# EAGLE schematic Board (EAGLE 9.6.2)
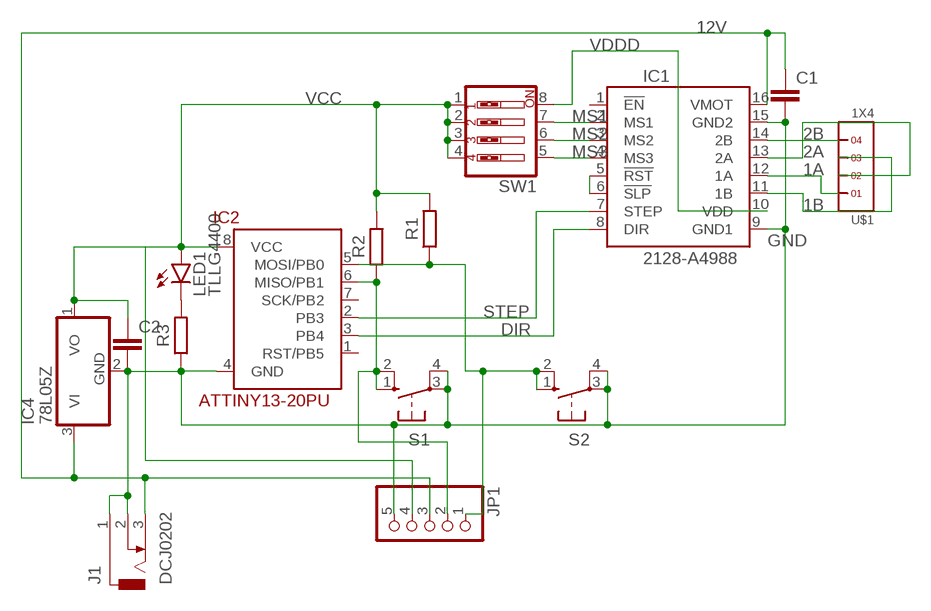
[diagram p0: schematic, sheet 1]

## Parts
C1  C2.5/6  [C2.5-6]
C2  C2.5/6  [C2.5-6]
IC1  2128-A4988  [A4988]
IC2  ATTINY13-20PU  [DIL08]
IC4  78L05Z  [TO92]
J1  DCJ0202  [DCJ0202]
JP1  PINHD-1X5  [1X05]
LED1  TLLG4400  [LED3MM]
R1  R_AXIAL-7.2MM-PITCH  [RESAD724W46L381D178B]
R2  R_AXIAL-7.2MM-PITCH  [RESAD724W46L381D178B]
R3  R_AXIAL-7.2MM-PITCH  [RESAD724W46L381D178B]
S1  10-XX  [B3F-10XX]
S2  10-XX  [B3F-10XX]
SW1  SW_DIP-4  [EDG-04]
U$1  1X4  [1X4]

## Nets
1A: IC1.12(1A) U$1.1
1B: IC1.11(1B) U$1.3
2A: IC1.13(2A) U$1.2
2B: IC1.14(2B) U$1.4
12V: C1.1 IC1.16(VMOT) IC4.3(VI) J1.3 JP1.3
DIR: IC1.8(DIR) IC2.3(PB4)
GND: C1.2 C2.2 IC1.9(GND1) IC1.15(GND2) IC2.4(GND) IC4.2(GND) J1.1 J1.2 JP1.5 R3.1 S1.3(P) S1.4(P1) S2.3(P) S2.4(P1)
MS1: IC1.2(MS1) SW1.7
MS2: IC1.3(MS2) SW1.6
MS3: IC1.4(MS3) SW1.5
N$7: LED1.K(C) R3.2
N$8: IC2.5(MOSI/PB0) JP1.1 R1.1 S2.1(S) S2.2(S1)
N$10: IC1.5(!RST) IC1.6(!SLP)
PB1: IC2.6(MISO/PB1) JP1.2 R2.1 S1.1(S) S1.2(S1)
STEP: IC1.7(STEP) IC2.2(PB3)
VCC: C2.1 IC2.8(VCC) IC4.1(VO) JP1.4 LED1.A R1.2 R2.2 SW1.1 SW1.2 SW1.3 SW1.4
VDDD: IC1.10(VDD) SW1.8
Unconnected: IC1.1(!EN) IC2.1(RST/PB5) IC2.7(SCK/PB2)

## Library data of the parts
C1 C2 = capacitor-wima:C: CAPACITOR naming: grid - package width
IC1 = pololu-stepper-driver:2128-A4988: A4988 Stepper Motor Driver Carrier; Black Edition #2128 A4988 Stepper Motor Driver Carrier; Black Edition <https://www.pololu.com/product/2128> in Japan, Suzaku Lab. Ltd. <https://suzakugiken.jp/> #2128 A4988ステッピングモータドライバ Black Edition <https://szc.jp/po2128>
IC2 = attiny13:ATTINY13-20*
IC4 = linear:78*: Positive VOLTAGE REGULATOR Source: http://cache.national.com/ds/LM/LM78L05.pdf http://www.fairchildsemi.com/ds/LM/LM7805.pdf
J1 = con-jack:DCJ0202: DC POWER JACK Source: DCJ0202.pdf; OC_FARNELL: unknown; OC_NEWARK: unknown
JP1 = pinhead:PINHD-1X5: PIN HEADER
LED1 = led:TLLG4400: Low Current (2mA) LED 3 mm Tinted Diffused Package color GREEN Source: Data sheet <http://www.farnell.com/datasheets/391098.pdf>; MF: VISHAY SEMICONDUCTOR; OC_FARNELL: 1612435
R1-R3 = Resistor:R: Resistor Fixed - Generic; CATEGORY: Resistor; SUB-CATEGORY: Fixed
S1 S2 = switch-omron:10-XX: OMRON SWITCH; MPN: B3F-1000; OC_FARNELL: 176432; OC_NEWARK: 36M3542
SW1 = special:SW_DIP-4: DIP SWITCH
U$1 = headers(2mm):1X4